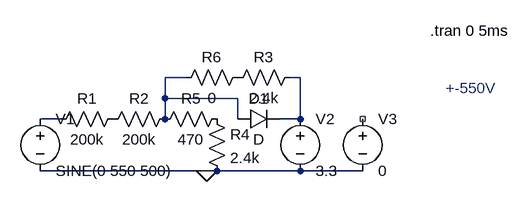
[diagram p0: schematic back_emf.asc]
back_emf.asc, the LTspice schematic file:
Version 4
SHEET 1 880 680
WIRE 304 224 272 224
WIRE 480 224 464 224
WIRE 272 256 272 224
WIRE 384 256 272 256
WIRE 112 288 80 288
WIRE 272 288 272 256
WIRE 384 288 384 256
WIRE 480 288 480 224
WIRE 480 288 448 288
WIRE 336 368 80 368
WIRE 352 368 336 368
WIRE 480 368 352 368
WIRE 576 368 480 368
FLAG 336 368 0
SYMBOL voltage 80 272 R0
SYMATTR InstName V1
SYMATTR Value SINE(0 550 500)
SYMBOL res 208 272 R90
WINDOW 0 0 56 VBottom 2
WINDOW 3 32 56 VTop 2
SYMATTR InstName R1
SYMATTR Value 200k
SYMBOL res 288 272 R90
WINDOW 0 0 56 VBottom 2
WINDOW 3 32 56 VTop 2
SYMATTR InstName R2
SYMATTR Value 200k
SYMBOL res 336 272 R0
SYMATTR InstName R4
SYMATTR Value 2.4k
SYMBOL voltage 480 272 R0
SYMATTR InstName V2
SYMATTR Value 3.3
SYMBOL voltage 576 272 R0
SYMATTR InstName V3
SYMATTR Value 0
SYMBOL res 368 272 R90
WINDOW 0 0 56 VBottom 2
WINDOW 3 32 56 VTop 2
SYMATTR InstName R5
SYMATTR Value 470
SYMBOL diode 384 304 R270
WINDOW 0 32 32 VTop 2
WINDOW 3 0 32 VBottom 2
SYMATTR InstName D1
SYMBOL res 480 208 R90
WINDOW 0 0 56 VBottom 2
WINDOW 3 32 56 VTop 2
SYMATTR InstName R3
SYMATTR Value 2.4k
SYMBOL res 400 208 R90
WINDOW 0 0 56 VBottom 2
WINDOW 3 32 56 VTop 2
SYMATTR InstName R6
SYMATTR Value 0
TEXT 680 152 Left 2 !.tran 0 5ms
TEXT 704 240 Left 2 ;+-550V

The netlist it stands for:
* back_emf.asc
V1 N003 0 SINE(0 550 500)
R1 P001 N003 200k
R2 N001 P001 200k
R4 P002 0 2.4k
V2 N002 0 3.3
V3 NC_01 0 0
R5 P002 N001 470
D1 N001 N002 D
R3 N002 P003 2.4k
R6 P003 N001 0
.model D D
.lib standard.dio
.tran 0 5ms
* +-550V
.backanno
.end